# EAGLE schematic 3_3volt_rail (EAGLE 7.0.0)
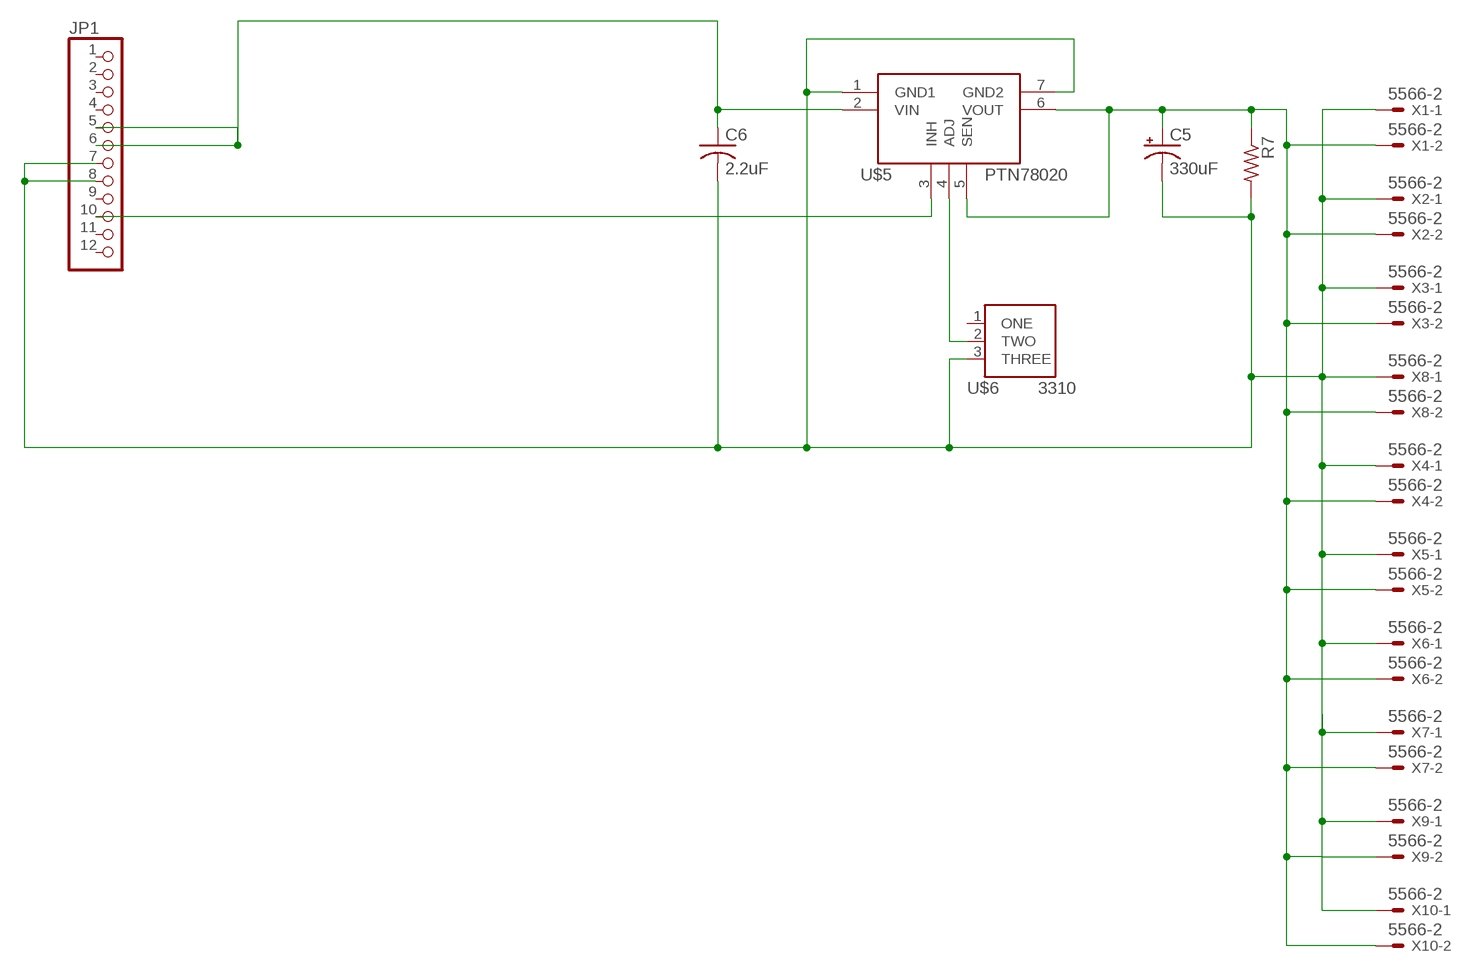
[diagram p0: schematic, sheet 1]

## Parts
C5  330uF  CPOL-USE5-10.5  [E5-10,5]
C6  2.2uF  C-USC0805  [C0805]
JP1  PINHD-1X12  [1X12]
R7  R-US_M0805  [M0805]
U$5  PTH78020-SMD  [PTN78020-SND]
U$6  3310-001  [3310-001-TH]
X1  5566-2  [5566-2]
X2  5566-2  [5566-2]
X3  5566-2  [5566-2]
X4  5566-2  [5566-2]
X5  5566-2  [5566-2]
X6  5566-2  [5566-2]
X7  5566-2  [5566-2]
X8  5566-2  [5566-2]
X9  5566-2  [5566-2]
X10  5566-2  [5566-2]

## Nets
N$3: C5.+ R7.1 U$5.5(SEN) U$5.6(VOUT) X1.2 X2.2 X3.2 X4.2 X5.2 X6.2 X7.2 X8.2 X9.2 X10.2
N$4: C5.- C6.2 JP1.7 JP1.8 R7.2 U$5.1(GND1) U$5.7(GND2) U$6.3(THREE) X1.1 X2.1 X3.1 X4.1 X5.1 X6.1 X7.1 X8.1 X9.1 X10.1
N$7: JP1.10 U$5.3(INH)
N$11: C6.1 JP1.5 JP1.6 U$5.2(VIN)
N$17: U$5.4(ADJ) U$6.2(TWO)
Unconnected: JP1.1 JP1.2 JP1.3 JP1.4 JP1.9 JP1.11 JP1.12 U$6.1(ONE)

## Library data of the parts
C5 = rcl:CPOL-US: POLARIZED CAPACITOR, American symbol
C6 = adafruit:C-US: CAPACITOR, American symbol
JP1 = adafruit:PINHD-1X12: PIN HEADER
R7 = adafruit:R-US_: RESISTOR, American symbol
U$5 = PTN78020:PTH78020-SMD
U$6 = 3310-001:3310-001
X1-X10 = con-molex:5566-2: Mini FIT connector 2 pol Source: http://www.molex.com; OC_FARNELL: 1822072; OC_NEWARK: unknown